# Altium project Arapuca.PrjPcb
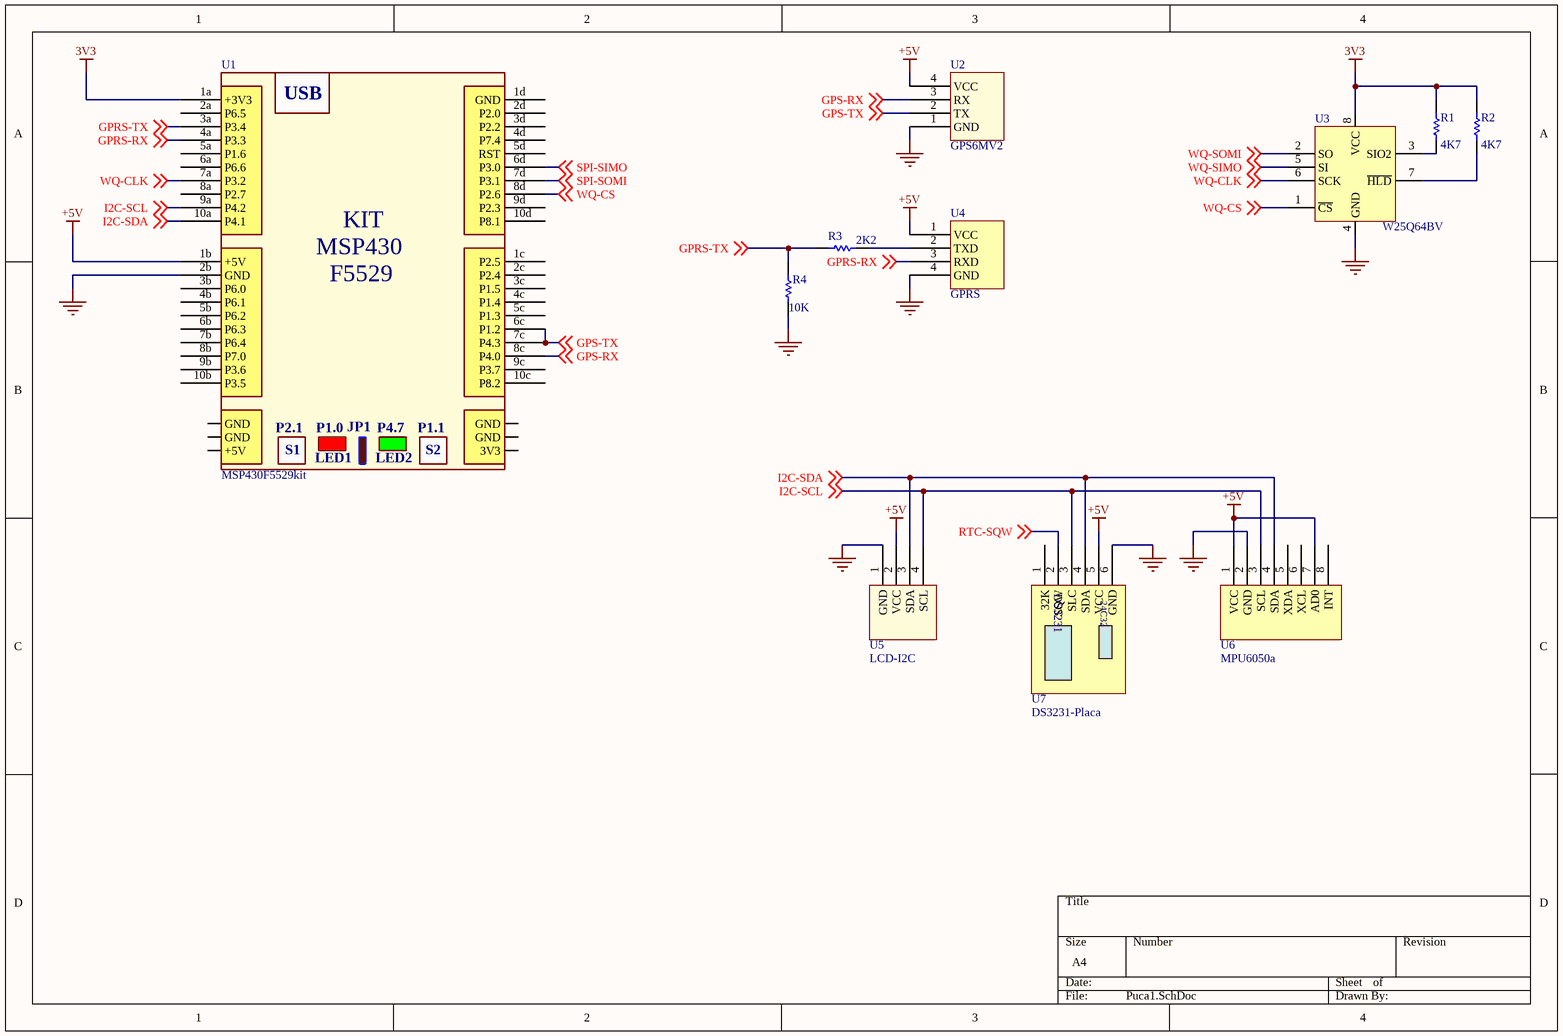
[diagram p0: Puca1.SchDoc]
1 sheet, 11 parts. Net scope: global (net labels, ports and power ports of the same name join across sheets).

## Sheet Puca1.SchDoc
size A4

### Parts
R1  value 4K7  [AXIAL-0.3]  (hidden comment: Res1)
R2  value 4K7  [AXIAL-0.3]  (hidden comment: Res1)
R3  value 2K2  [AXIAL-0.3]  (hidden comment: Res1)
R4  value 10K  [AXIAL-0.3]  (hidden comment: Res1)
U1  MSP430F5529kit
U2  GPS6MV2
U3  W25Q64BV
U4  GPRS
U5  LCD-I2C
U6  MPU6050a
U7  DS3231-Placa

### Nets
3V3: R1.1 R2.2 U1.1a(+3V3) U3.8(VCC)
+5V: U1.1b(+5V) U2.4(VCC) U4.1(VCC) U5.2(VCC) U6.1(VCC) U6.7(AD0) U7.5(VCC)
NetR4_2: R4.2 U1.2b(GND) U2.1(GND) U3.4(GND) U4.4(GND) U5.1(GND) U6.2(GND) U7.6(GND)
GPRS-RX: U1.4a(P3.3) U4.3(RXD) ; off-sheet GPRS-RX
GPRS-TX: R3.2 R4.1 U1.3a(P3.4) ; off-sheet GPRS-TX
GPS-RX: U1.8c(P4.0) U2.3(RX) ; off-sheet GPS-RX
GPS-TX: U1.6c(P1.2) U1.7c(P4.3) U2.2(TX) ; off-sheet GPS-TX
I2C-SCL: U1.9a(P4.2) U5.4(SCL) U6.3(SCL) U7.3(SLC) ; off-sheet I2C-SCL
I2C-SDA: U1.10a(P4.1) U5.3(SDA) U6.4(SDA) U7.4(SDA) ; off-sheet I2C-SDA
RTC-SQW: U7.2(SQW) ; off-sheet RTC-SQW
SPI-SIMO: U1.6d(P3.0) ; off-sheet SPI-SIMO
SPI-SOMI: U1.7d(P3.1) ; off-sheet SPI-SOMI
WQ-CLK: U1.7a(P3.2) U3.6(SCK) ; off-sheet WQ-CLK
WQ-CS: U1.8d(P2.6) U3.1(~{CS}) ; off-sheet WQ-CS
WQ-SIMO: U3.5(SI) ; off-sheet WQ-SIMO
WQ-SOMI: U3.2(SO) ; off-sheet WQ-SOMI
NetR1_2: R1.2 U3.3(SIO2)
NetR2_1: R2.1 U3.7(~{HLD})
NetR3_1: R3.1 U4.2(TXD)

Not connected (* = marked no-connect by the designer): U1 1c(P2.5) 1d(GND) 2a(P6.5) 2c(P2.4) 2d(P2.0) 3b(P6.0) 3c(P1.5) 3d(P2.2) 3V3 4b(P6.1) 4c(P1.4) 4d(P7.4) 5a(P1.6) 5b(P6.2) 5c(P1.3) 5d(RST) 6a(P6.6) 6b(P6.3) 7b(P6.4) 8a(P2.7) 8b(P7.0) 9b(P3.6) 9c(P3.7) 9d(P2.3) 10b(P3.5) 10c(P8.2) 10d(P8.1) +5V GND; U6 5(XDA) 6(XCL) 8(INT); U7 1(32K)

### Notes on the sheet
- (in symbol DS3231-Placa) 24C32; DS3231
- (in symbol MSP430F5529kit) USB; KIT; MSP430; F5529; P2.1; P1.0; JP1; P4.7; P1.1; S1; S2; LED1; LED2

### Library data of the parts
R1-R4 = Res1: Resistor; Published: 8-Jun-2000; LatestRevisionDate: 17-Jul-2002; LatestRevisionNote: Re-released for DXP Platform.; PackageReference: AXIAL-0.3; Publisher: Altium Limited; PackageDescription: Axial Device, Thru-Hole; 2 Leads; 0.3 in Pin Spacing
U3 = W25Q64BV: FLASH 8MB